# Altium project FMC_SDR.PrjPcb (part 2 of 2)

## Sheet Transceiver.SchDoc: FMC SDR Transceiver Board
size 420 x 297 mm; CheckedBy: -; CompanyName: CERN; DrawnBy: DrawnBy; Organization: CERN; Address1: European Organization for Nuclear Research; Address2: CH-1211 Genčve 23 - Switzerland; Revision: -; SheetNumber: -; SheetTotal: -; EDA_Number: EDA-XXXXX-VX-X; Projet: -; ModifiedBy: -; CreateDate: XX/XX/XXXX; CheckedDate: -; Title2: AD9364; DivGrp: TE/MPE; Designer: Designer; ModifiedDate: -
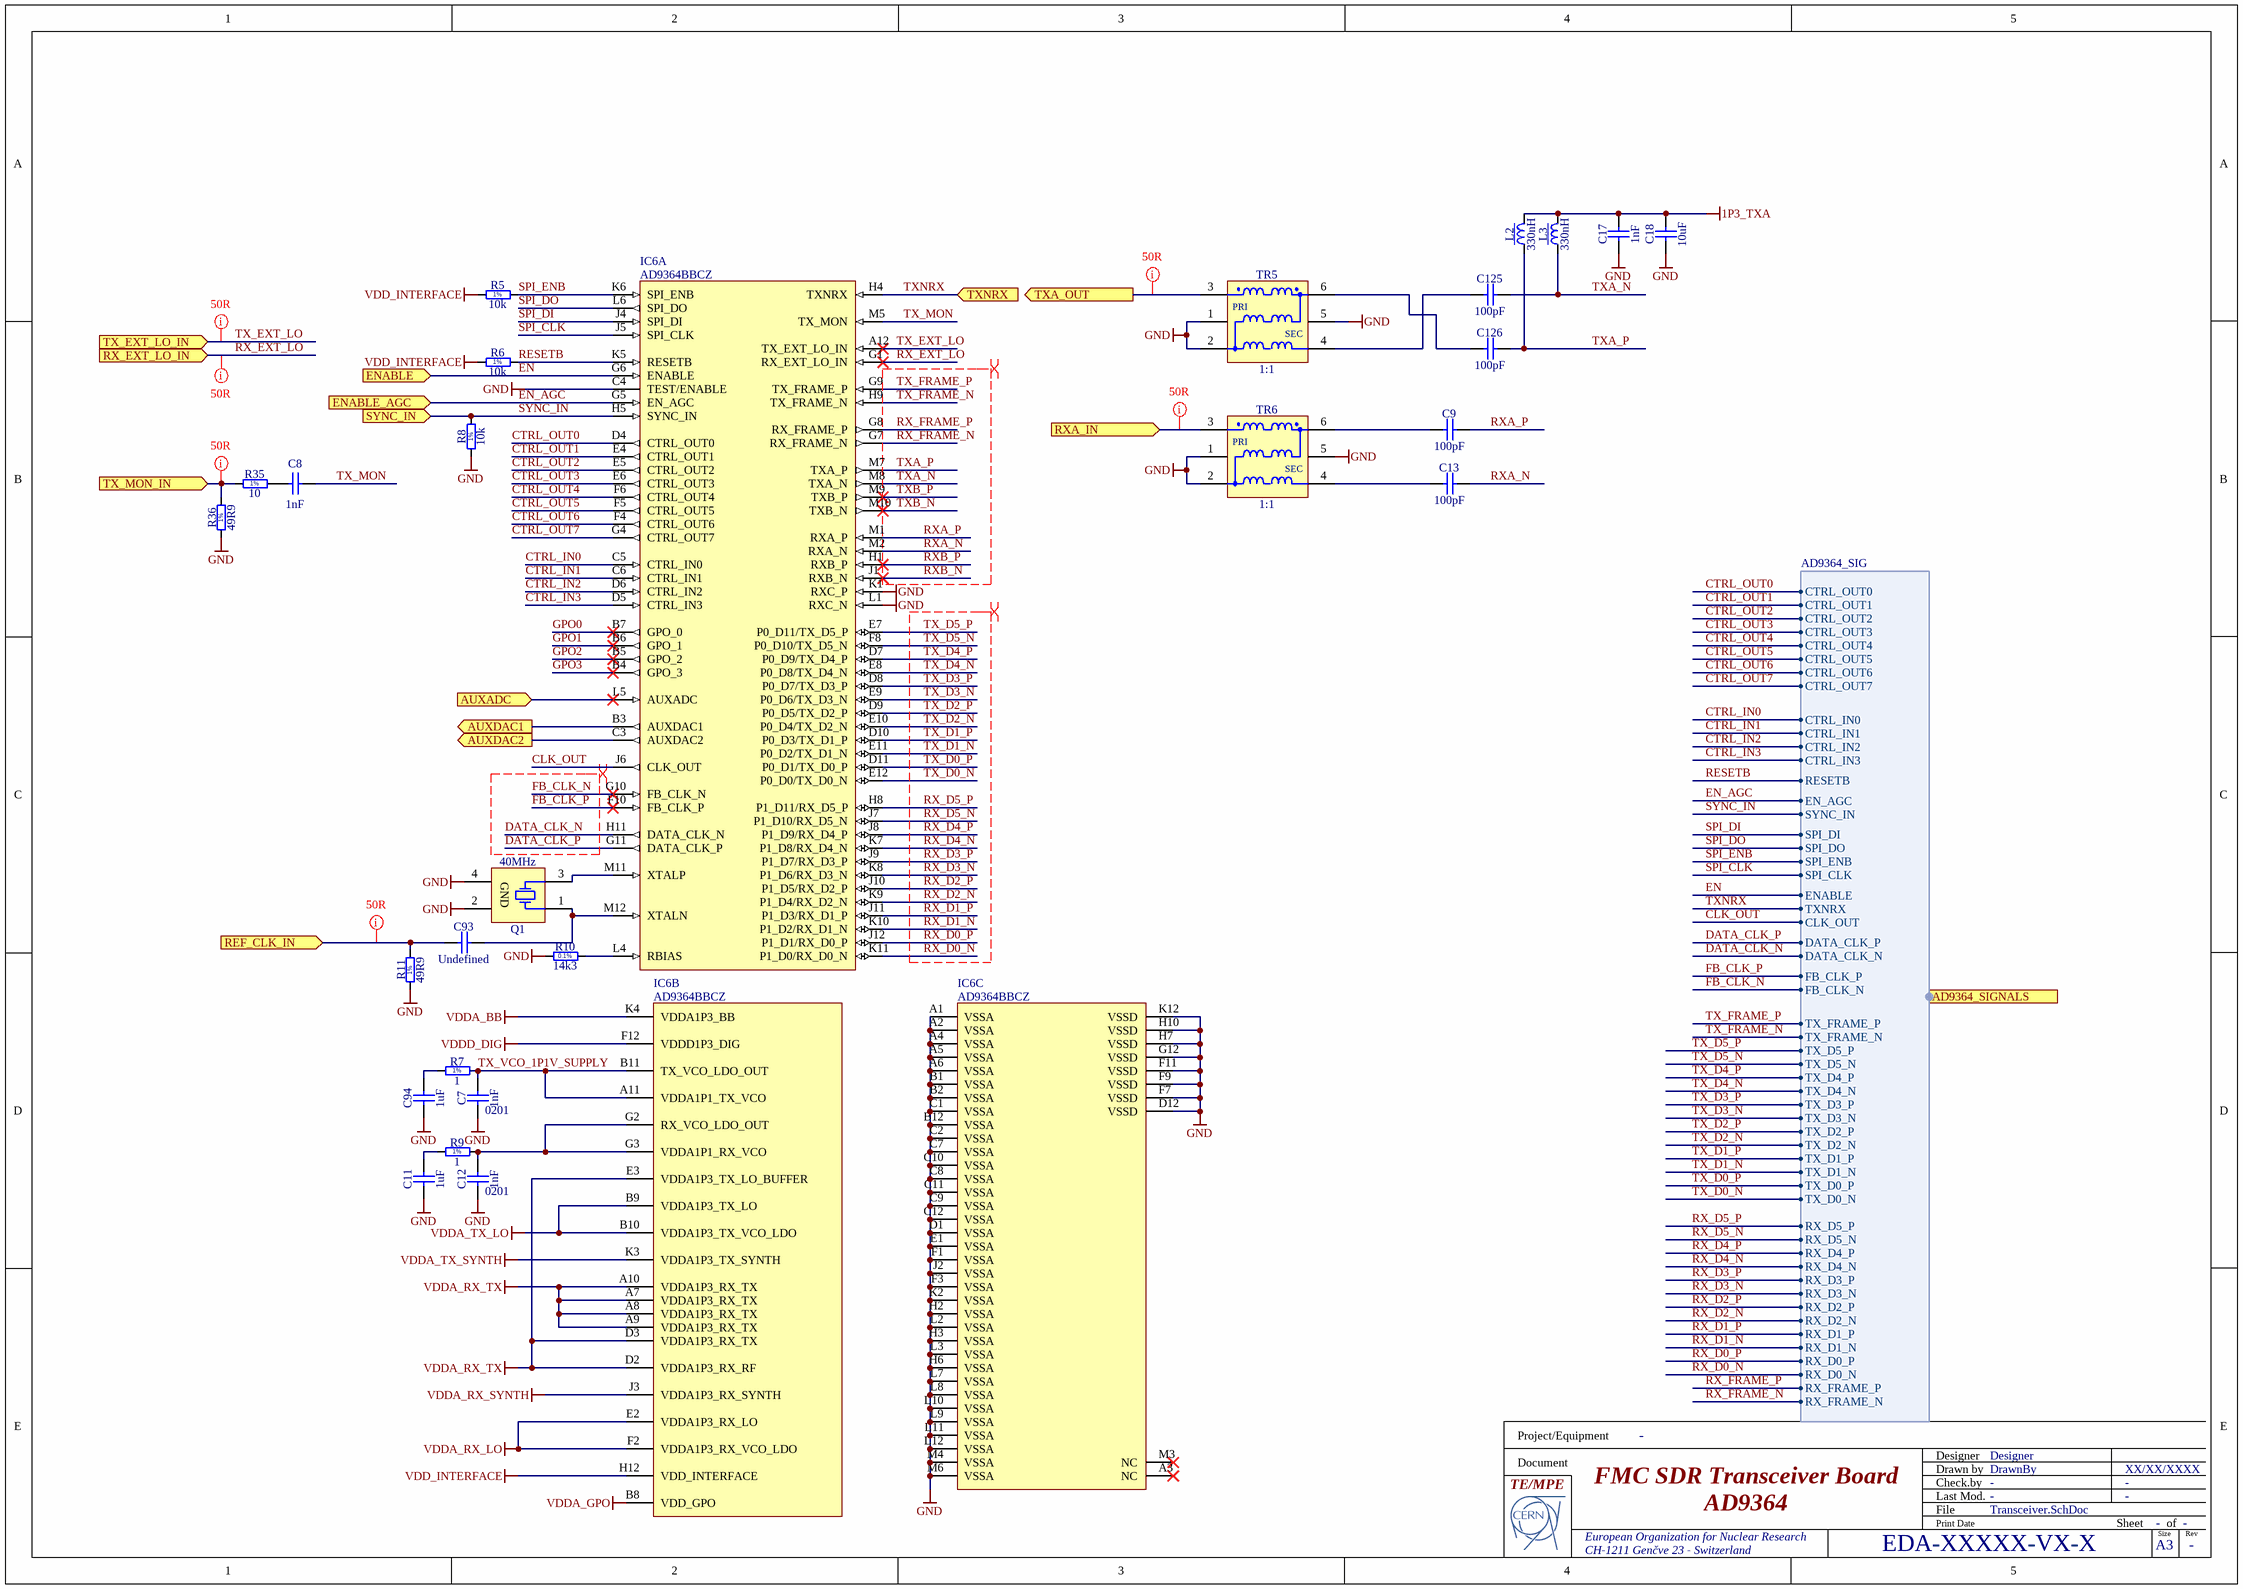
[diagram p3: Transceiver.SchDoc]

### Parts
C7  1nF  Case: 0201  [CAPC0603X33N]
C8  1nF  [CAPC1005X55N]
C9  100pF  [CAPC1005X55N]
C11  1uF  [CAPC1005X55N]
C12  1nF  Case: 0201  [CAPC0603X33N]
C13  100pF  [CAPC1005X55N]
C17  1nF  [CAPC1005X55N]
C18  10uF  [CAPC1608X80N]
C93  Undefined  [CAPC1608X90N]
C94  1uF  [CAPC1005X55N]
C125  100pF  [CAPC1005X55N]
C126  100pF  [CAPC1005X55N]
IC6  AD9364BBCZ  [BGA144C80P12X12_1000X1000X170]  (parts A,B,C of 3)
L2  330nH  [IND_COILCRAFT_0805CS]
L3  330nH  [IND_COILCRAFT_0805CS]
Q1  40MHz  [XTAL_EPSON_TSX-3225]
R5  10k  [RESC1005X40N]
R6  10k  [RESC1005X40N]
R7  1  [RESC1005X40N]
R8  10k  [RESC1005X40N]
R9  1  [RESC1005X40N]
R10  14k3  [RESC1608X55N]
R11  49R9  [RESC1005X40N]
R35  10  [RESC1005X40N]
R36  49R9  [RESC1005X40N]
TR5  1:1  [XFMR_MINI-CIRCUITS_DB1627]
TR6  1:1  [XFMR_MINI-CIRCUITS_DB1627]

### Ports
AD9364_SIGNALS (in, harness AD9364_SIG), AUXADC (in), AUXDAC1 (out), AUXDAC2 (out), ENABLE (in), ENABLE_AGC (in), REF_CLK_IN (in), RX_EXT_LO_IN (in), RXA_IN (in), SYNC_IN (in), TX_EXT_LO_IN (in), TX_MON_IN (in), TXA_OUT (out), TXNRX (in)

### Harnesses
AD9364_SIG: CTRL_OUT0, CTRL_OUT1, CTRL_OUT2, CTRL_OUT3, CTRL_OUT4, CTRL_OUT5, CTRL_OUT6, CTRL_OUT7, CTRL_IN0, CTRL_IN1, CTRL_IN2, CTRL_IN3, RESETB, EN_AGC, SYNC_IN, SPI_DI, SPI_DO, SPI_ENB, SPI_CLK, ENABLE, TXNRX, CLK_OUT, DATA_CLK_P, DATA_CLK_N, FB_CLK_P, FB_CLK_N, TX_FRAME_P, TX_FRAME_N, TX_D5_P, TX_D5_N, TX_D4_P, TX_D4_N, TX_D3_P, TX_D3_N, TX_D2_P, TX_D2_N, TX_D1_P, TX_D1_N, TX_D0_P, TX_D0_N, RX_D5_P, RX_D5_N, RX_D4_P, RX_D4_N, RX_D3_P, RX_D3_N, RX_D2_P, RX_D2_N, RX_D1_P, RX_D1_N, RX_D0_P, RX_D0_N, RX_FRAME_P, RX_FRAME_N

### Nets
1P3_TXA: C17.2 C18.2 IC6.A7(VDDA1P3_RX_TX) IC6.A8(VDDA1P3_RX_TX) IC6.A9(VDDA1P3_RX_TX) IC6.A10(VDDA1P3_RX_TX) IC6.D2(VDDA1P3_RX_RF) IC6.D3(VDDA1P3_RX_TX) IC6.E3(VDDA1P3_TX_LO_BUFFER) IC6.F12(VDDD1P3_DIG) IC6.K4(VDDA1P3_BB) L2.2 L3.2  [also labelled VDDA_BB, VDDA_RX_TX, VDDD_DIG]  [project net 1P3_SUPPLY_B]
GND: C7.1 C11.1 C12.1 C17.1 C18.1 C94.1 IC6.A1(VSSA) IC6.A2(VSSA) IC6.A4(VSSA) IC6.A5(VSSA) IC6.A6(VSSA) IC6.B1(VSSA) IC6.B2(VSSA) IC6.B12(VSSA) IC6.C1(VSSA) IC6.C2(VSSA) IC6.C4(TEST/ENABLE) IC6.C7(VSSA) IC6.C8(VSSA) IC6.C9(VSSA) IC6.C10(VSSA) IC6.C11(VSSA) IC6.C12(VSSA) IC6.D1(VSSA) IC6.D12(VSSD) IC6.E1(VSSA) IC6.F1(VSSA) IC6.F3(VSSA) IC6.F7(VSSD) IC6.F9(VSSD) IC6.F11(VSSD) IC6.G12(VSSD) IC6.H2(VSSA) IC6.H3(VSSA) IC6.H6(VSSA) IC6.H7(VSSD) IC6.H10(VSSD) IC6.J2(VSSA) IC6.K1(RXC_P) IC6.K2(VSSA) IC6.K12(VSSD) IC6.L1(RXC_N) IC6.L2(VSSA) IC6.L3(VSSA) IC6.L7(VSSA) IC6.L8(VSSA) IC6.L9(VSSA) IC6.L10(VSSA) IC6.L11(VSSA) IC6.L12(VSSA) IC6.M4(VSSA) IC6.M6(VSSA) Q1.2(GND) Q1.4(GND) R8.1 R10.1 R11.1 R36.1 TR5.1(NC) TR5.2(P1) TR5.5(NC) TR6.1(NC) TR6.2(P1) TR6.5(NC)
VDD_INTERFACE: IC6.H12(VDD_INTERFACE) R5.1 R6.1
VDDA_GPO: IC6.B8(VDD_GPO)
VDDA_RX_LO: IC6.B9(VDDA1P3_TX_LO) IC6.B10(VDDA1P3_TX_VCO_LDO) IC6.E2(VDDA1P3_RX_LO) IC6.F2(VDDA1P3_RX_VCO_LDO) IC6.J3(VDDA1P3_RX_SYNTH) IC6.K3(VDDA1P3_TX_SYNTH)  [also labelled VDDA_RX_SYNTH, VDDA_TX_LO, VDDA_TX_SYNTH]  [project net 1P3_SUPPLY_A]
CLK_OUT: IC6.J6(CLK_OUT) ; port AD9364_SIGNALS.CLK_OUT  [project net 9364_CLK_OUT]
CTRL_IN0: IC6.C5(CTRL_IN0) ; port AD9364_SIGNALS.CTRL_IN0  [project net 9364_CTRL_IN0]
CTRL_IN1: IC6.C6(CTRL_IN1) ; port AD9364_SIGNALS.CTRL_IN1  [project net 9364_CTRL_IN1]
CTRL_IN2: IC6.D6(CTRL_IN2) ; port AD9364_SIGNALS.CTRL_IN2  [project net 9364_CTRL_IN2]
CTRL_IN3: IC6.D5(CTRL_IN3) ; port AD9364_SIGNALS.CTRL_IN3  [project net 9364_CTRL_IN3]
CTRL_OUT0: IC6.D4(CTRL_OUT0) ; port AD9364_SIGNALS.CTRL_OUT0  [project net 9364_CTRL_OUT0]
CTRL_OUT1: IC6.E4(CTRL_OUT1) ; port AD9364_SIGNALS.CTRL_OUT1  [project net 9364_CTRL_OUT1]
CTRL_OUT2: IC6.E5(CTRL_OUT2) ; port AD9364_SIGNALS.CTRL_OUT2  [project net 9364_CTRL_OUT2]
CTRL_OUT3: IC6.E6(CTRL_OUT3) ; port AD9364_SIGNALS.CTRL_OUT3  [project net 9364_CTRL_OUT3]
CTRL_OUT4: IC6.F6(CTRL_OUT4) ; port AD9364_SIGNALS.CTRL_OUT4  [project net 9364_CTRL_OUT4]
CTRL_OUT5: IC6.F5(CTRL_OUT5) ; port AD9364_SIGNALS.CTRL_OUT5  [project net 9364_CTRL_OUT5]
CTRL_OUT6: IC6.F4(CTRL_OUT6) ; port AD9364_SIGNALS.CTRL_OUT6  [project net 9364_CTRL_OUT6]
CTRL_OUT7: IC6.G4(CTRL_OUT7) ; port AD9364_SIGNALS.CTRL_OUT7  [project net 9364_CTRL_OUT7]
DATA_CLK_N: IC6.H11(DATA_CLK_N) ; port AD9364_SIGNALS.DATA_CLK_N  [project net 9364_DATA_CLK_N]
DATA_CLK_P: IC6.G11(DATA_CLK_P) ; port AD9364_SIGNALS.DATA_CLK_P  [project net 9364_DATA_CLK_P]
EN: IC6.G6(ENABLE) ; port ENABLE, port AD9364_SIGNALS.ENABLE  [project net 9364_ENABLE]
EN_AGC: IC6.G5(EN_AGC) ; port ENABLE_AGC, port AD9364_SIGNALS.EN_AGC  [project net 9364_EN_AGC]
FB_CLK_N: IC6.G10(FB_CLK_N) ; port AD9364_SIGNALS.FB_CLK_N  [project net 9364_FB_CLK_N]
FB_CLK_P: IC6.F10(FB_CLK_P) ; port AD9364_SIGNALS.FB_CLK_P  [project net 9364_FB_CLK_P]
GPO0: IC6.B7(GPO_0)
GPO1: IC6.B6(GPO_1)
GPO2: IC6.B5(GPO_2)
GPO3: IC6.B4(GPO_3)
RESETB: IC6.K5(RESETB) R6.2 ; port AD9364_SIGNALS.RESETB  [project net 9364_RESETB]
RX_D0_N: IC6.K11(P1_D0/RX_D0_N) ; port AD9364_SIGNALS.RX_D0_N  [project net 9364_RX_D0_N]
RX_D0_P: IC6.J12(P1_D1/RX_D0_P) ; port AD9364_SIGNALS.RX_D0_P  [project net 9364_RX_D0_P]
RX_D1_N: IC6.K10(P1_D2/RX_D1_N) ; port AD9364_SIGNALS.RX_D1_N  [project net 9364_RX_D1_N]
RX_D1_P: IC6.J11(P1_D3/RX_D1_P) ; port AD9364_SIGNALS.RX_D1_P  [project net 9364_RX_D1_P]
RX_D2_N: IC6.K9(P1_D4/RX_D2_N) ; port AD9364_SIGNALS.RX_D2_N  [project net 9364_RX_D2_N]
RX_D2_P: IC6.J10(P1_D5/RX_D2_P) ; port AD9364_SIGNALS.RX_D2_P  [project net 9364_RX_D2_P]
RX_D3_N: IC6.K8(P1_D6/RX_D3_N) ; port AD9364_SIGNALS.RX_D3_N  [project net 9364_RX_D3_N]
RX_D3_P: IC6.J9(P1_D7/RX_D3_P) ; port AD9364_SIGNALS.RX_D3_P  [project net 9364_RX_D3_P]
RX_D4_N: IC6.K7(P1_D8/RX_D4_N) ; port AD9364_SIGNALS.RX_D4_N  [project net 9364_RX_D4_N]
RX_D4_P: IC6.J8(P1_D9/RX_D4_P) ; port AD9364_SIGNALS.RX_D4_P  [project net 9364_RX_D4_P]
RX_D5_N: IC6.J7(P1_D10/RX_D5_N) ; port AD9364_SIGNALS.RX_D5_N  [project net 9364_RX_D5_N]
RX_D5_P: IC6.H8(P1_D11/RX_D5_P) ; port AD9364_SIGNALS.RX_D5_P  [project net 9364_RX_D5_P]
RX_EXT_LO: IC6.G1(RX_EXT_LO_IN) ; port RX_EXT_LO_IN
RX_FRAME_N: IC6.G7(RX_FRAME_N) ; port AD9364_SIGNALS.RX_FRAME_N  [project net 9364_RX_FRAME_N]
RX_FRAME_P: IC6.G8(RX_FRAME_P) ; port AD9364_SIGNALS.RX_FRAME_P  [project net 9364_RX_FRAME_P]
RXA_N: C13.2 IC6.M2(RXA_N)
RXA_P: C9.2 IC6.M1(RXA_P)
RXB_N: IC6.J1(RXB_N)
RXB_P: IC6.H1(RXB_P)
SPI_CLK: IC6.J5(SPI_CLK) ; port AD9364_SIGNALS.SPI_CLK  [project net 9364_SPI_CLK]
SPI_DI: IC6.J4(SPI_DI) ; port AD9364_SIGNALS.SPI_DI  [project net 9364_SPI_DI]
SPI_DO: IC6.L6(SPI_DO) ; port AD9364_SIGNALS.SPI_DO  [project net 9364_SPI_DO]
SPI_ENB: IC6.K6(SPI_ENB) R5.2 ; port AD9364_SIGNALS.SPI_ENB  [project net 9364_SPI_ENB]
SYNC_IN: IC6.H5(SYNC_IN) R8.2 ; port SYNC_IN, port AD9364_SIGNALS.SYNC_IN  [project net 9364_SYNC_IN]
TX_D0_N: IC6.E12(P0_D0/TX_D0_N) ; port AD9364_SIGNALS.TX_D0_N  [project net 9364_TX_D0_N]
TX_D0_P: IC6.D11(P0_D1/TX_D0_P) ; port AD9364_SIGNALS.TX_D0_P  [project net 9364_TX_D0_P]
TX_D1_N: IC6.E11(P0_D2/TX_D1_N) ; port AD9364_SIGNALS.TX_D1_N  [project net 9364_TX_D1_N]
TX_D1_P: IC6.D10(P0_D3/TX_D1_P) ; port AD9364_SIGNALS.TX_D1_P  [project net 9364_TX_D1_P]
TX_D2_N: IC6.E10(P0_D4/TX_D2_N) ; port AD9364_SIGNALS.TX_D2_N  [project net 9364_TX_D2_N]
TX_D2_P: IC6.D9(P0_D5/TX_D2_P) ; port AD9364_SIGNALS.TX_D2_P  [project net 9364_TX_D2_P]
TX_D3_N: IC6.E9(P0_D6/TX_D3_N) ; port AD9364_SIGNALS.TX_D3_N  [project net 9364_TX_D3_N]
TX_D3_P: IC6.D8(P0_D7/TX_D3_P) ; port AD9364_SIGNALS.TX_D3_P  [project net 9364_TX_D3_P]
TX_D4_N: IC6.E8(P0_D8/TX_D4_N) ; port AD9364_SIGNALS.TX_D4_N  [project net 9364_TX_D4_N]
TX_D4_P: IC6.D7(P0_D9/TX_D4_P) ; port AD9364_SIGNALS.TX_D4_P  [project net 9364_TX_D4_P]
TX_D5_N: IC6.F8(P0_D10/TX_D5_N) ; port AD9364_SIGNALS.TX_D5_N  [project net 9364_TX_D5_N]
TX_D5_P: IC6.E7(P0_D11/TX_D5_P) ; port AD9364_SIGNALS.TX_D5_P  [project net 9364_TX_D5_P]
TX_EXT_LO: IC6.A12(TX_EXT_LO_IN) ; port TX_EXT_LO_IN
TX_FRAME_N: IC6.H9(TX_FRAME_N) ; port AD9364_SIGNALS.TX_FRAME_N  [project net 9364_TX_FRAME_N]
TX_FRAME_P: IC6.G9(TX_FRAME_P) ; port AD9364_SIGNALS.TX_FRAME_P  [project net 9364_TX_FRAME_P]
TX_MON: C8.1 IC6.M5(TX_MON)
TX_VCO_1P1V_SUPPLY: C7.2 IC6.A11(VDDA1P1_TX_VCO) IC6.B11(TX_VCO_LDO_OUT) R7.2
TXA_N: C125.2 IC6.M8(TXA_N) L3.1
TXA_P: C126.2 IC6.M7(TXA_P) L2.1
TXB_N: IC6.M10(TXB_N)
TXB_P: IC6.M9(TXB_P)
TXNRX: IC6.H4(TXNRX) ; port TXNRX, port AD9364_SIGNALS.TXNRX  [project net 9364_TXNRX]
NetBSC1_1: TR5.3(P1) ; port TXA_OUT
NetBSC2_1: C93.1 R11.2 ; port REF_CLK_IN
NetBSC3_1: R35.1 R36.2 ; port TX_MON_IN
NetBSC5_1: TR6.3(P1) ; port RXA_IN
NetBSC14_1: IC6.B3(AUXDAC1) ; port AUXDAC1
NetBSC21_1: IC6.L5(AUXADC) ; port AUXADC
NetC8_2: C8.2 R35.2
NetC9_1: C9.1 TR6.6(S1)
NetC11_2: C11.2 R9.1
NetC12_2: C12.2 IC6.G2(RX_VCO_LDO_OUT) IC6.G3(VDDA1P1_RX_VCO) R9.2
NetC13_1: C13.1 TR6.4(S1)
NetC93_2: C93.2 IC6.M12(XTALN) Q1.1(X)
NetC94_2: C94.2 R7.1
NetC125_1: C125.1 TR5.4(S1)
NetC126_1: C126.1 TR5.6(S1)
NetIC6_C3: IC6.C3(AUXDAC2) ; port AUXDAC2
NetIC6_L4: IC6.L4(RBIAS) R10.2
NetIC6_M11: IC6.M11(XTALP) Q1.3(X)

Not connected (* = marked no-connect by the designer): IC6 A3(NC)* M3(NC)*

### Layout directives
differential pair: DATA_CLK_N, DATA_CLK_P, FB_CLK_N, FB_CLK_P, RX_D0_N, RX_D0_P, RX_D1_N, RX_D1_P, RX_D2_N, RX_D2_P, RX_D3_N, RX_D3_P, RX_D4_N, RX_D4_P, RX_D5_N, RX_D5_P, RX_FRAME_N, RX_FRAME_P, RXA_N, RXA_P, RXB_N, RXB_P, TX_D0_N, TX_D0_P, TX_D1_N, TX_D1_P, TX_D2_N, TX_D2_P, TX_D3_N, TX_D3_P, TX_D4_N, TX_D4_P, TX_D5_N, TX_D5_P, TX_FRAME_N, TX_FRAME_P, TXA_N, TXA_P, TXB_N, TXB_P
net class 50R_class: NetBSC1_1, NetBSC2_1, NetBSC3_1, NetBSC5_1, RX_EXT_LO, TX_EXT_LO

### Notes on the sheet
- Project/Equipment
- Document
- Designer
- Drawn by
- Check.by
- File
- Last Mod.
- Print Date
- Sheet
- Size
- A3
- of
- Rev
- (in symbol R0402_1R_1%_0.0625W_200PPM) 1%
- (in symbol R0402_10K_1%_0.0625W_100PPM) 1%
- (in symbol R0402_10R_1%_0.0625W_200PPM) 1%
- (in symbol R0402_49R9_1%_0.0625W_100PPM) 1%
- (in symbol R0603_14K3_0.1%_0.063W_10PPM) 0.1%
- (in symbol XFMR_MINI-CIRCUITS_TCM1-63AX+) PRI; SEC

### Library data of the parts
C7 C12 = CC0201_1NF_16V_10%_X5R: Non-polarised capacitor; Part Description: SMD Multilayer Chip Ceramic Capacitor; Manufacturer: GENERIC; Manufacturer1 Part Number: 0201YD102KAT2A; Voltage: 16V; TC: X5R; Tolerance: ±10%; Part Number: CC0201_1NF_16V_10%_X5R; Component Kind: Standard; Component Type: Standard; Pin Count: 2; Value: 1nF; Status: Not Recommended; Manufacturer Part Number: CC0201_1NF_16V_10%_X5R; Mounted: Yes; Socket: No; SMD: Yes; Sense: No; Manufacturer1 Example: AVX; Manufacturer1 ComponentHeight: 0.33mm; HelpURL: \\cern.ch\dfs\Applications\Altium\Datasheets\CC0201_X5R_AVX.pdf; Author: CERN DEM JLC; CreateDate: 03.12.2007; LatestRevisionDate: 03.12.2007
C8 C17 = CC0402_1NF_50V_10%_X7R: Non-polarised capacitor; Part Description: SMD Multilayer Chip Ceramic Capacitor; Manufacturer: GENERIC; Manufacturer1 Part Number: 223858715623; Voltage: 50V; TC: X7R; Tolerance: ±10%; Part Number: CC0402_1NF_50V_10%_X7R; Component Kind: Standard; Component Type: Standard; Pin Count: 2; Value: 1nF; Status: Not Recommended; Manufacturer Part Number: CC0402_1NF_50V_10%_X7R; Case: 0402; Mounted: Yes; Socket: No; SMD: Yes; Sense: No; Manufacturer1 Example: PHYCOMP; Manufacturer1 ComponentHeight: 0.55mm; HelpURL: \\cern.ch\dfs\Applications\Altium\Datasheets\CC0402_X7R_PHYCOMP.pdf; Author: CERN DEM JLC; CreateDate: 03.12.2007; LatestRevisionDate: 03.12.2007
C9 C13 C125 C126 = CC0402_100PF_50V_5%_C0G: Non-polarised capacitor; Part Description: SMD Multilayer Chip Ceramic Capacitor; Manufacturer: GENERIC; Manufacturer1 Part Number: C0402C101J5GACTU; Voltage: 50V; TC: C0G/NP0; Tolerance: ±5%; Part Number: CC0402_100PF_50V_5%_C0G; Component Kind: Standard; Component Type: Standard; Pin Count: 2; Value: 100pF; Status: Preferred; Manufacturer Part Number: CC0402_100PF_50V_5%_C0G; Case: 0402; Mounted: Yes; Socket: No; SMD: Yes; Sense: No; Manufacturer1 Example: KEMET; Manufacturer1 ComponentHeight: 0.55mm; HelpURL: \\cern.ch\dfs\Applications\Altium\Datasheets\CC0805_C0G_KEMET_(Commercial Grade).pdf; Author: CERN DEM JLC; CreateDate: 03.12.2007; LatestRevisionDate: 22.04.2015
C11 C94 = CC0402_1UF_16V_10%_X5R: Non-polarised capacitor; Part Description: SMD Multilayer Chip Ceramic Capacitor; Manufacturer: GENERIC; Manufacturer1 Part Number: C1005X5R1C105KT; Voltage: 16V; TC: X5R; Tolerance: ±10%; Part Number: CC0402_1UF_16V_10%_X5R; Component Kind: Standard; Component Type: Standard; Pin Count: 2; Value: 1uF; Status: Preferred; Manufacturer Part Number: CC0402_1UF_16V_10%_X5R; Case: 0402; Mounted: Yes; Socket: No; SMD: Yes; Sense: No; Manufacturer1 Example: TDK; Manufacturer1 ComponentHeight: 0.55mm; HelpURL: \\cern.ch\dfs\Applications\Altium\Datasheets\CC0402_X5R_TDK_C.pdf; Author: CERN DEM JLC; CreateDate: 25.10.2012; LatestRevisionDate: 25.10.2012
C18 = CC0603_10UF_10V_10%_X5R: Non-polarised capacitor; Part Description: SMD Multilayer Chip Ceramic Capacitor; Manufacturer: GENERIC; Manufacturer1 Part Number: GRM188R61A106KE69D; Voltage: 10V; TC: X5R; Tolerance: ±10%; Part Number: CC0603_10UF_10V_10%_X5R; Component Kind: Standard; Component Type: Standard; Pin Count: 2; Value: 10uF; Status: None; Manufacturer Part Number: CC0603_10UF_10V_10%_X5R; Case: 0603; Mounted: Yes; Socket: No; SMD: Yes; Sense: No; Manufacturer1 Example: MURATA; Manufacturer1 ComponentHeight: 0.8mm; HelpURL: \\cern.ch\dfs\Applications\Altium\Datasheets\CC0603_MURATA_GRM188R61A106KE69D.pdf; Author: CERN DEM JLC; CreateDate: 31.01.2017; LatestRevisionDate: 31.01.2017
C93 = CC0603_NO-VALUE: Non-polarised capacitor; Part Description: Reserved Footprint For 0603(1608) Chip Ceramic Capacitor; Mounted: No; Part Number: CC0603_NO-VALUE; Component Kind: Standard; Component Type: Standard; Pin Count: 2; Value: Undefined; Status: None; Manufacturer: Undefined; Manufacturer Part Number: CC0603_NO-VALUE; Case: 0603; Socket: No; SMD: Yes; Sense: No; Manufacturer1 ComponentHeight: 0.9mm; HelpURL: Undefined; Author: CERN DEM MR; CreateDate: 22.11.2016; LatestRevisionDate: 22.11.2016
IC6 = AD9364BBCZ: RF 1×1 transceiver with integrated 12-bit DACs and ADCs; Manufacturer: ANALOG DEVICES; PressFit: No; Bonding: No; Part Number: AD9364BBCZ; Component Kind: Standard; Component Type: Standard; Device: AD9364BBCZ; PackageDescription: BGA, 0.80mm Pitch, Square; 144 Pin,12 Columns X 12 Rows,10.00mm X 10.00mm X 1.70mm H; Part Description: RF 1 × 1 Transceiver with Integrated 12-bit DACs and ADCs; Manufacturer Part Number: AD9364BBCZ; Pin Count: 144; Case: BGA144; Mounted: Yes; Socket: No; SMD: Yes; Sense: No; ComponentHeight: 1.7mm; Author: CERN DEM JLC; HelpURL: \\cern.ch\dfs\Applications\Altium\Datasheets\AD9364BBCZ.pdf; CreateDate: 06.12.2018; LatestRevisionDate: 06.12.2018
L2 L3 = IND_330NH_2%_COILCRAFT_0805CS: Inductor With Core; Part Description: SMT Chip Inductor; Manufacturer Part Number: 0805CS-331XGL; Power: 310mA; Resistance: 1.4R; Tolerance: ±2%; Part Number: IND_330NH_2%_COILCRAFT_0805CS; Component Kind: Standard; Component Type: Standard; Pin Count: 2; Value: 330nH; Status: None; Manufacturer: COILCRAFT; Case: 0805; Mounted: Yes; Socket: No; SMD: Yes; Sense: No; ComponentHeight: 1.52mm; HelpURL: \\cern.ch\dfs\Applications\Altium\Datasheets\IND_COILCRAFT_0805CS.pdf; Author: CERN DEM JMW; CreateDate: 26.10.2015; LatestRevisionDate: 26.10.2015
Q1 = X_CRYSTAL_SMD_3.2x2.5_40MHz: 40MHz ±10ppm Crystal 7pF 40 Ohms 4-SMD, No Lead; Part Number: XTAL_24MHZ_EPSON_ X1E000021036701; Part Description: Tolerance ±10 ppm,  Stability:± 10ppm, -40°C to 85°C, 9pF, Surface Mount Quartz Crystal, TX-3225 Series; Manufacturer: EPSON; Manufacturer Part Number: X1E000021036701; PressFit: No; Component Kind: Standard; Component Type: Standard; PackageDescription: Crystal TSX-3225 Serie, Corner Concave; 4 pin, 2.50mm L X 3.2mm W X 0.6mm H; Value: 40MHz; Pin Count: 4; Mounted: Yes; Socket: No; SMD: Yes; Sense: No; Bonding: No; ComponentHeight: 0.6mm; HelpURL: \\cern.ch\dfs\Applications\Altium\Datasheets\XTAL_EPSON_TSX-3225.pdf; ComponentLink1URL: \\cern.ch\dfs\Applications\Altium\Datasheets\XTAL_EPSON_TSX-3225_Ordering-Informations.pdf; ComponentLink1Description: Ordering Informations; Author: GK; CreateDate: 06.10.2016; LatestRevisionDate: 06.10.2016
R5 R6 R8 = R0402_10K_1%_0.0625W_100PPM: Resistor - 1%; Part Description: General Purpose Thick Film Chip Resistor; Manufacturer: GENERIC; Manufacturer1 Part Number: 232270671003L; TC: ±100ppm/°C; PressFit: No; Part Number: R0402_10K_1%_0.0625W_100PPM; Component Kind: Standard; Component Type: Standard; Pin Count: 2; Value: 10k; Status: Not Recommended; Power: 0.0625W; Tolerance: ±1%; Manufacturer Part Number: R0402_10K_1%_0.0625W_100PPM; Case: 0402; Mounted: Yes; Sense: No; Socket: No; SMD: Yes; Manufacturer1 Example: YAGEO PHYCOMP; Manufacturer1 ComponentHeight: 0.4mm; HelpURL: \\cern.ch\dfs\Applications\Altium\Datasheets\R0402_Phycomp_RC0402.pdf; Author: CERN DEM JLC; CreateDate: 03.12.2007; LatestRevisionDate: 17.10.2012
R7 R9 = R0402_1R_1%_0.0625W_200PPM: Resistor - 1%; Part Description: General Purpose Thick Film Chip Resistor; Manufacturer: GENERIC; Manufacturer1 Part Number: 232270671008L; TC: ±200ppm/°C; PressFit: No; Part Number: R0402_1R_1%_0.0625W_200PPM; Component Kind: Standard; Component Type: Standard; Pin Count: 2; Value: 1; Status: Not Recommended; Power: 0.0625W; Tolerance: ±1%; Manufacturer Part Number: R0402_1R_1%_0.0625W_200PPM; Case: 0402; Mounted: Yes; Sense: No; Socket: No; SMD: Yes; Manufacturer1 Example: YAGEO PHYCOMP; Manufacturer1 ComponentHeight: 0.4mm; HelpURL: \\cern.ch\dfs\Applications\Altium\Datasheets\R0402_Phycomp_RC0402.pdf; Author: CERN DEM JLC; CreateDate: 03.12.2007; LatestRevisionDate: 17.10.2012
R10 = R0603_14K3_0.1%_0.063W_10PPM: Resistor - 0.1%; Part Description: Thin Film Chip Resistor; Manufacturer: GENERIC; Manufacturer1 Part Number: RN73C1J14K3BTDF; Power: 0.063W; TC: ±10ppm; PressFit: No; Part Number: R0603_14K3_0.1%_0.063W_10PPM; Component Kind: Standard; Component Type: Standard; Pin Count: 2; Value: 14k3; Status: Not Recommended; Tolerance: ±0.1%; Manufacturer Part Number: R0603_14K3_0.1%_0.063W_10PPM; Case: 0603; Mounted: Yes; Sense: No; Socket: No; SMD: Yes; Manufacturer1 Example: TYCO HOLSWORTHY; Manufacturer1 ComponentHeight: 0.5mm; HelpURL: \\cern.ch\dfs\Applications\Altium\Datasheets\R0603_Tyco_RN73.pdf; Author: CERN DEM JLC; CreateDate: 03.12.2007; LatestRevisionDate: 13.03.2008
R11 R36 = R0402_49R9_1%_0.0625W_100PPM: Resistor - 1%; Part Description: General Purpose Thick Film Chip Resistor; Manufacturer: GENERIC; Manufacturer1 Part Number: 232270674999L or RC0402FR-0749R9L; TC: ±100ppm/°C; PressFit: No; Part Number: R0402_49R9_1%_0.0625W_100PPM; Component Kind: Standard; Component Type: Standard; Pin Count: 2; Value: 49R9; Status: Not Recommended; Power: 0.0625W; Tolerance: ±1%; Manufacturer Part Number: R0402_49R9_1%_0.0625W_100PPM; Case: 0402; Mounted: Yes; Sense: No; Socket: No; SMD: Yes; Manufacturer1 Example: YAGEO PHYCOMP; Manufacturer1 ComponentHeight: 0.4mm; HelpURL: \\cern.ch\dfs\Applications\Altium\Datasheets\R0402_Phycomp_RC0402.pdf; Author: CERN DEM JLC; CreateDate: 24.10.2012; LatestRevisionDate: 24.10.2012
R35 = R0402_10R_1%_0.0625W_200PPM: Resistor - 1%; Part Description: General Purpose Thick Film Chip Resistor; Manufacturer: GENERIC; Manufacturer1 Part Number: 232270671009L; TC: ±200ppm/°C; PressFit: No; Part Number: R0402_10R_1%_0.0625W_200PPM; Component Kind: Standard; Component Type: Standard; Pin Count: 2; Value: 10; Status: Not Recommended; Power: 0.0625W; Tolerance: ±1%; Manufacturer Part Number: R0402_10R_1%_0.0625W_200PPM; Case: 0402; Mounted: Yes; Sense: No; Socket: No; SMD: Yes; Manufacturer1 Example: YAGEO PHYCOMP; Manufacturer1 ComponentHeight: 0.4mm; HelpURL: \\cern.ch\dfs\Applications\Altium\Datasheets\R0402_Phycomp_RC0402.pdf; Author: CERN DEM JLC; CreateDate: 24.06.2009; LatestRevisionDate: 17.10.2012
TR5 TR6 = XFMR_MINI-CIRCUITS_TCM1-63AX+: 50 Ohms 10  to 6000MHz RF Transformer; Power: 0.2W; Part Number: XFMR_MINI-CIRCUITS_TCM1-63AX+; Component Kind: Standard; Component Type: Standard; Pin Count: 6; Value: 1:1; Status: None; Part Description: 50 Ohms 10  to 6000MHz RF Transformer; Manufacturer: MINI-CIRCUITS; Manufacturer Part Number: TCM1-63AX+; Mounted: Yes; Socket: No; Sense: No; SMD: Yes; ComponentHeight: 4.06mm; HelpURL: \\cern.ch\dfs\Applications\Altium\Datasheets\XFMR_MINI-CIRCUITS_TCM1-63AX+.pdf; Author: CERN DEM MR; CreateDate: 08.02.2019; LatestRevisionDate: 08.02.2019

## Sheet fmc_connector.SchDoc: FMC SDR Transceiver Board
size 420 x 297 mm; CheckedBy: -; CompanyName: CERN; DrawnBy: DrawnBy; Organization: CERN; Address1: European Organization for Nuclear Research; Address2: CH-1211 Genčve 23 - Switzerland; Revision: -; SheetNumber: -; SheetTotal: -; EDA_Number: EDA-XXXXX-VX-X; Projet: -; ModifiedBy: -; CreateDate: XX/XX/XXXX; CheckedDate: -; Title2: FMC Connector; DivGrp: TE/MPE; Designer: Designer; ModifiedDate: -
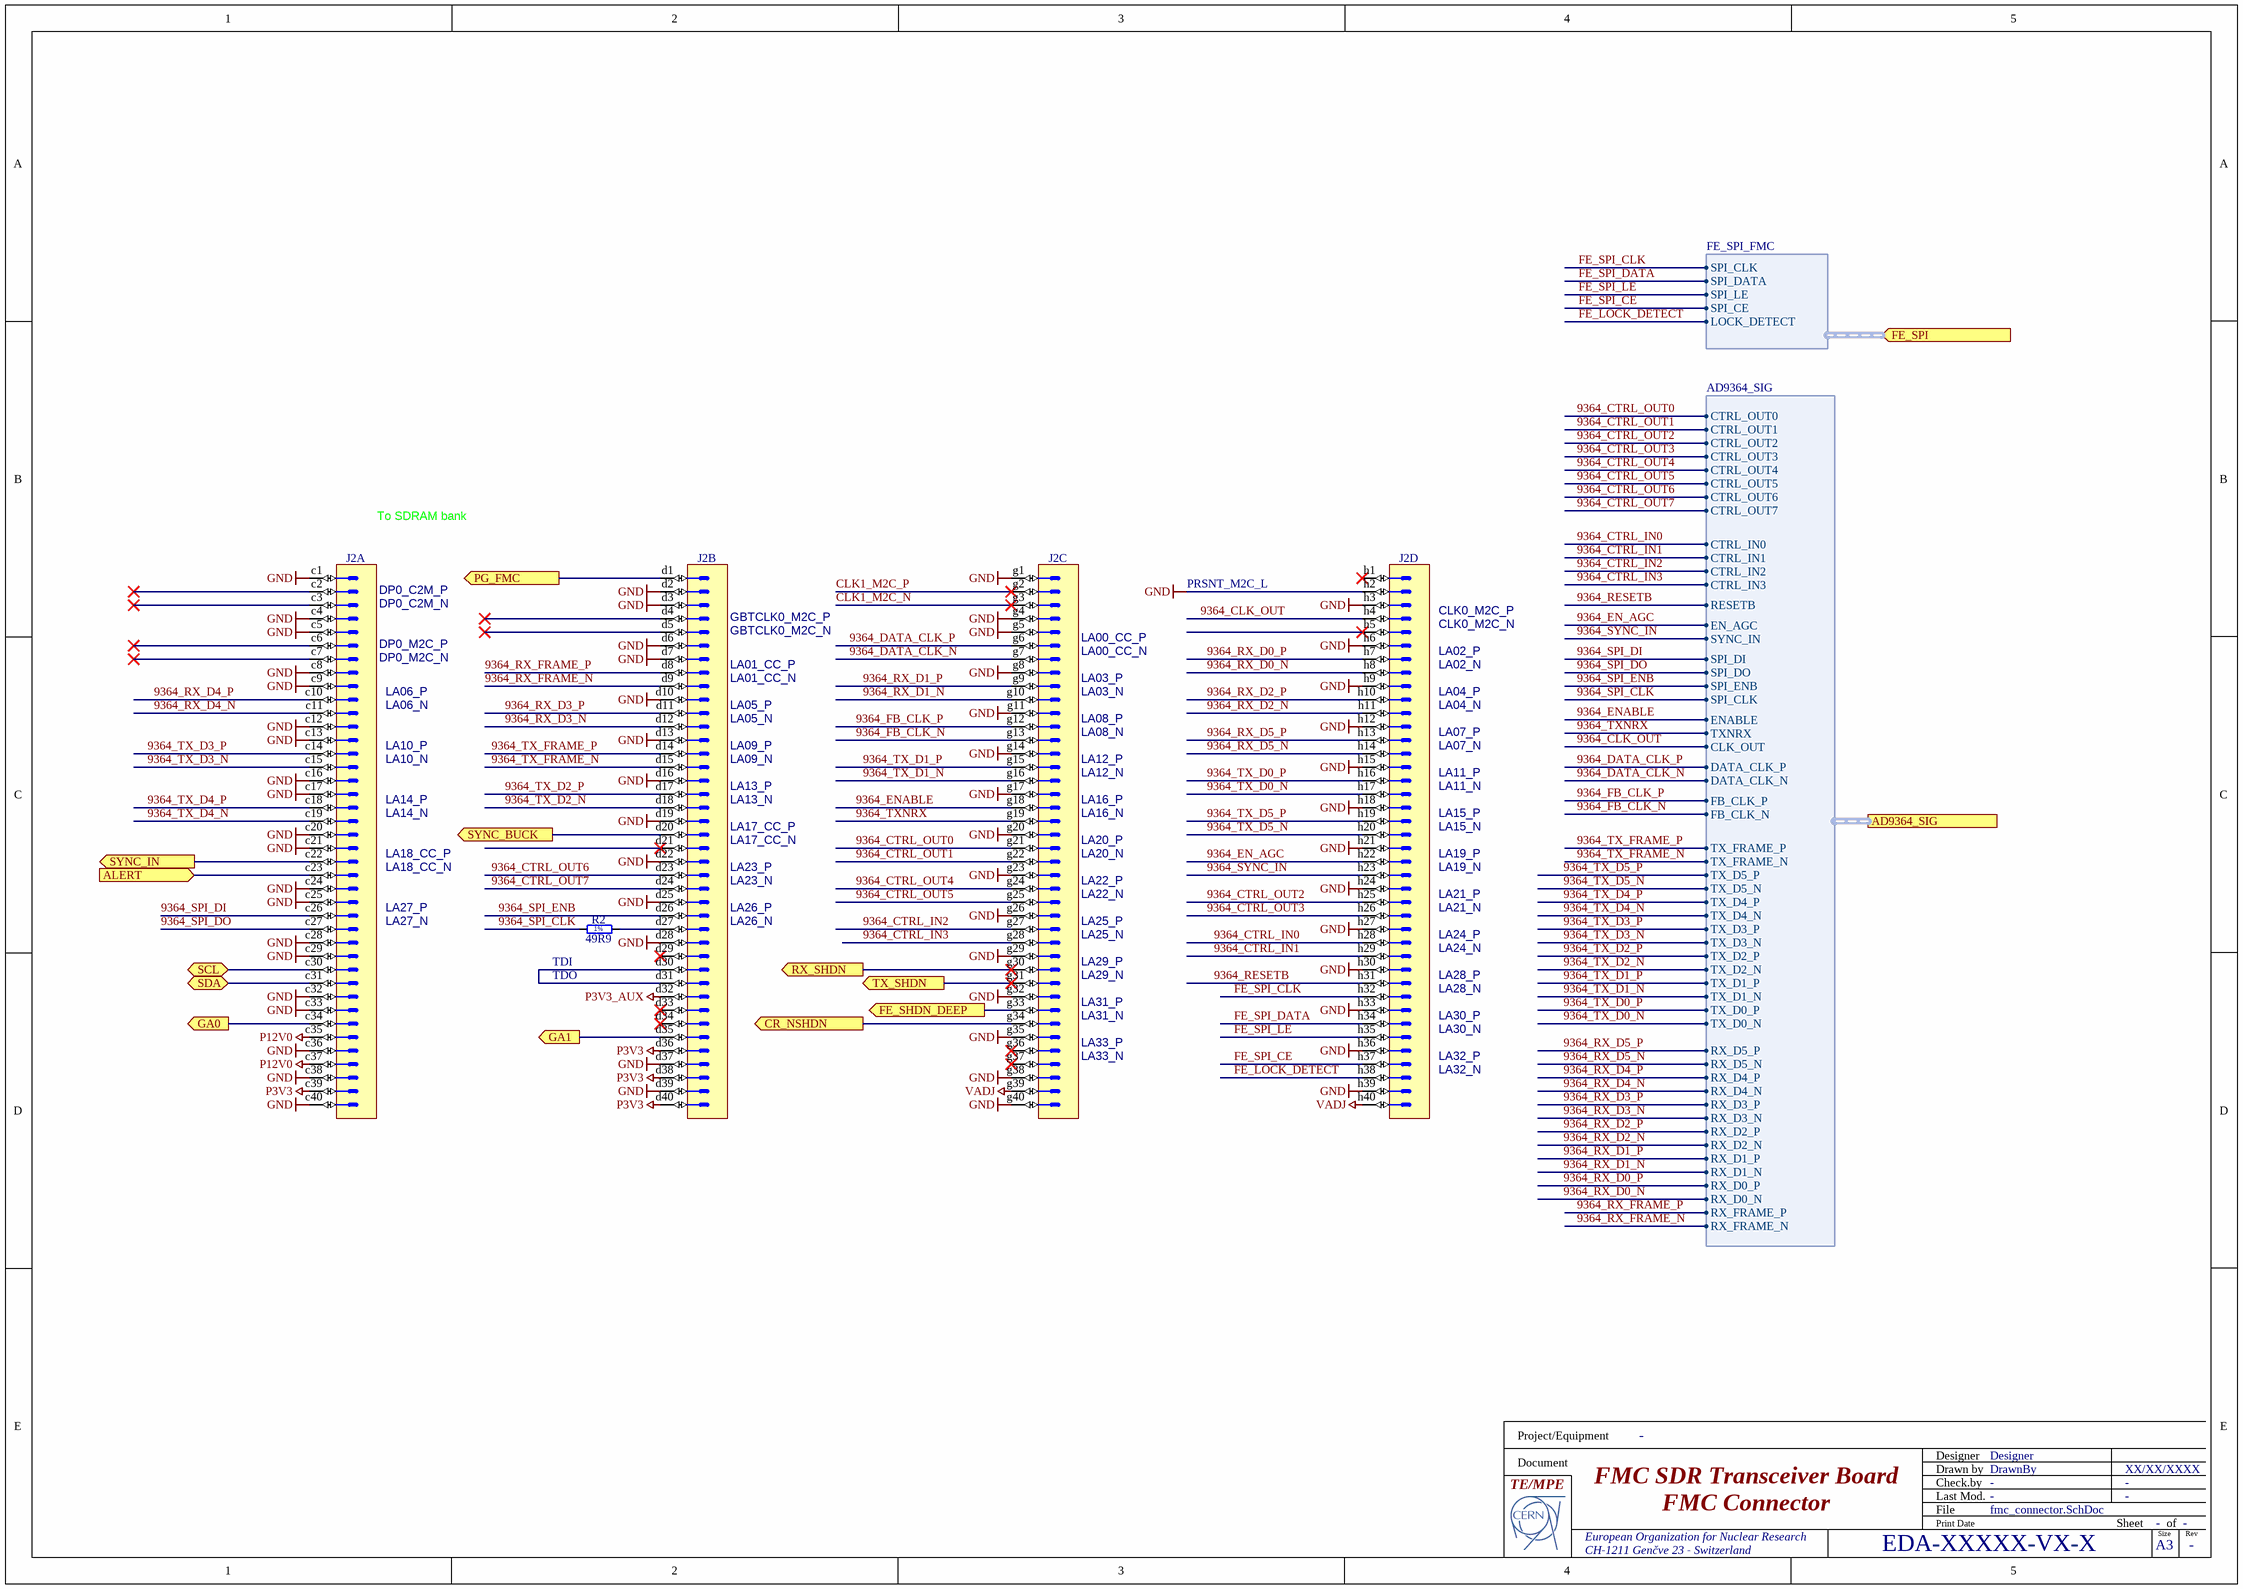
[diagram p4: fmc_connector.SchDoc]

### Parts
J2  VITA 57  [SAMTEC_ASP-127797-01]  (value not drawn)  (parts A,B,C,D of 4)
R2  49R9  [RESC1005X40N]

### Ports
AD9364_SIG (harness AD9364_SIG), ALERT (in), CR_NSHDN (out), FE_SHDN_DEEP (out), FE_SPI (in, harness FE_SPI_FMC), GA0 (out), GA1 (out), PG_FMC (out), RX_SHDN (out), SCL (bidir), SDA (bidir), SYNC_BUCK (out), SYNC_IN (out), TX_SHDN (out)

### Harnesses
AD9364_SIG: CTRL_OUT0, CTRL_OUT1, CTRL_OUT2, CTRL_OUT3, CTRL_OUT4, CTRL_OUT5, CTRL_OUT6, CTRL_OUT7, CTRL_IN0, CTRL_IN1, CTRL_IN2, CTRL_IN3, RESETB, EN_AGC, SYNC_IN, SPI_DI, SPI_DO, SPI_ENB, SPI_CLK, ENABLE, TXNRX, CLK_OUT, DATA_CLK_P, DATA_CLK_N, FB_CLK_P, FB_CLK_N, TX_FRAME_P, TX_FRAME_N, TX_D5_P, TX_D5_N, TX_D4_P, TX_D4_N, TX_D3_P, TX_D3_N, TX_D2_P, TX_D2_N, TX_D1_P, TX_D1_N, TX_D0_P, TX_D0_N, RX_D5_P, RX_D5_N, RX_D4_P, RX_D4_N, RX_D3_P, RX_D3_N, RX_D2_P, RX_D2_N, RX_D1_P, RX_D1_N, RX_D0_P, RX_D0_N, RX_FRAME_P, RX_FRAME_N
FE_SPI_FMC: SPI_CLK, SPI_DATA, SPI_LE, SPI_CE, LOCK_DETECT

### Nets
GND: J2.c1 J2.c4 J2.c5 J2.c8 J2.c9 J2.c12 J2.c13 J2.c16 J2.c17 J2.c20 J2.c21 J2.c24 J2.c25 J2.c28 J2.c29 J2.c32 J2.c33 J2.c36 J2.c38 J2.c40 J2.d2 J2.d3 J2.d6 J2.d7 J2.d10 J2.d13 J2.d16 J2.d19 J2.d22 J2.d25 J2.d28 J2.d37 J2.d39 J2.g1 J2.g4 J2.g5 J2.g8 J2.g11 J2.g14 J2.g17 J2.g20 J2.g23 J2.g26 J2.g29 J2.g32 J2.g35 J2.g38 J2.g40 J2.h2 J2.h3 J2.h6 J2.h9 J2.h12 J2.h15 J2.h18 J2.h21 J2.h24 J2.h27 J2.h30 J2.h33 J2.h36 J2.h39
P3V3: J2.c39 J2.d36 J2.d38 J2.d40
P3V3_AUX: J2.d32
P12V0: J2.c35 J2.c37
VADJ: J2.g39 J2.h40
9364_CLK_OUT: J2.h4 ; port AD9364_SIG.CLK_OUT
9364_CTRL_IN0: J2.h28 ; port AD9364_SIG.CTRL_IN0
9364_CTRL_IN1: J2.h29 ; port AD9364_SIG.CTRL_IN1
9364_CTRL_IN2: J2.g27 ; port AD9364_SIG.CTRL_IN2
9364_CTRL_IN3: J2.g28 ; port AD9364_SIG.CTRL_IN3
9364_CTRL_OUT0: J2.g21 ; port AD9364_SIG.CTRL_OUT0
9364_CTRL_OUT1: J2.g22 ; port AD9364_SIG.CTRL_OUT1
9364_CTRL_OUT2: J2.h25 ; port AD9364_SIG.CTRL_OUT2
9364_CTRL_OUT3: J2.h26 ; port AD9364_SIG.CTRL_OUT3
9364_CTRL_OUT4: J2.g24 ; port AD9364_SIG.CTRL_OUT4
9364_CTRL_OUT5: J2.g25 ; port AD9364_SIG.CTRL_OUT5
9364_CTRL_OUT6: J2.d23 ; port AD9364_SIG.CTRL_OUT6
9364_CTRL_OUT7: J2.d24 ; port AD9364_SIG.CTRL_OUT7
9364_DATA_CLK_N: J2.g7 ; port AD9364_SIG.DATA_CLK_N
9364_DATA_CLK_P: J2.g6 ; port AD9364_SIG.DATA_CLK_P
9364_EN_AGC: J2.h22 ; port AD9364_SIG.EN_AGC
9364_ENABLE: J2.g18 ; port AD9364_SIG.ENABLE
9364_FB_CLK_N: J2.g13 ; port AD9364_SIG.FB_CLK_N
9364_FB_CLK_P: J2.g12 ; port AD9364_SIG.FB_CLK_P
9364_RESETB: J2.h31 ; port AD9364_SIG.RESETB
9364_RX_D0_N: J2.h8 ; port AD9364_SIG.RX_D0_N
9364_RX_D0_P: J2.h7 ; port AD9364_SIG.RX_D0_P
9364_RX_D1_N: J2.g10 ; port AD9364_SIG.RX_D1_N
9364_RX_D1_P: J2.g9 ; port AD9364_SIG.RX_D1_P
9364_RX_D2_N: J2.h11 ; port AD9364_SIG.RX_D2_N
9364_RX_D2_P: J2.h10 ; port AD9364_SIG.RX_D2_P
9364_RX_D3_N: J2.d12 ; port AD9364_SIG.RX_D3_N
9364_RX_D3_P: J2.d11 ; port AD9364_SIG.RX_D3_P
9364_RX_D4_N: J2.c11 ; port AD9364_SIG.RX_D4_N
9364_RX_D4_P: J2.c10 ; port AD9364_SIG.RX_D4_P
9364_RX_D5_N: J2.h14 ; port AD9364_SIG.RX_D5_N
9364_RX_D5_P: J2.h13 ; port AD9364_SIG.RX_D5_P
9364_RX_FRAME_N: J2.d9 ; port AD9364_SIG.RX_FRAME_N
9364_RX_FRAME_P: J2.d8 ; port AD9364_SIG.RX_FRAME_P
9364_SPI_CLK: R2.1 ; port AD9364_SIG.SPI_CLK
9364_SPI_DI: J2.c26 ; port AD9364_SIG.SPI_DI
9364_SPI_DO: J2.c27 ; port AD9364_SIG.SPI_DO
9364_SPI_ENB: J2.d26 ; port AD9364_SIG.SPI_ENB
9364_SYNC_IN: J2.c22 J2.h23 ; port SYNC_IN, port AD9364_SIG.SYNC_IN
9364_TX_D0_N: J2.h17 ; port AD9364_SIG.TX_D0_N
9364_TX_D0_P: J2.h16 ; port AD9364_SIG.TX_D0_P
9364_TX_D1_N: J2.g16 ; port AD9364_SIG.TX_D1_N
9364_TX_D1_P: J2.g15 ; port AD9364_SIG.TX_D1_P
9364_TX_D2_N: J2.d18 ; port AD9364_SIG.TX_D2_N
9364_TX_D2_P: J2.d17 ; port AD9364_SIG.TX_D2_P
9364_TX_D3_N: J2.c15 ; port AD9364_SIG.TX_D3_N
9364_TX_D3_P: J2.c14 ; port AD9364_SIG.TX_D3_P
9364_TX_D4_N: J2.c19 ; port AD9364_SIG.TX_D4_N
9364_TX_D4_P: J2.c18 ; port AD9364_SIG.TX_D4_P
9364_TX_D5_N: J2.h20 ; port AD9364_SIG.TX_D5_N
9364_TX_D5_P: J2.h19 ; port AD9364_SIG.TX_D5_P
9364_TX_FRAME_N: J2.d15 ; port AD9364_SIG.TX_FRAME_N
9364_TX_FRAME_P: J2.d14 ; port AD9364_SIG.TX_FRAME_P
9364_TXNRX: J2.g19 ; port AD9364_SIG.TXNRX
CLK1_M2C_N: J2.g3
CLK1_M2C_P: J2.g2
FE_LOCK_DETECT: J2.h38 ; port FE_SPI.LOCK_DETECT
FE_SPI_CE: J2.h37 ; port FE_SPI.SPI_CE
FE_SPI_CLK: J2.h32 ; port FE_SPI.SPI_CLK
FE_SPI_DATA: J2.h34 ; port FE_SPI.SPI_DATA
FE_SPI_LE: J2.h35 ; port FE_SPI.SPI_LE
PGood_FMC: J2.d1 ; port PG_FMC
SynchronizeDCDC: J2.d20 ; port SYNC_BUCK
NetBSC12_1: J2.g34 ; port CR_NSHDN
NetBSC15_1: J2.g30 ; port RX_SHDN
NetBSC16_1: J2.g31 ; port TX_SHDN
NetBSC17_1: J2.g33 ; port FE_SHDN_DEEP
NetIC1_11: J2.c34 ; port GA0
NetIC1_13: J2.d35 ; port GA1
NetIC1_14: J2.c30 ; port SCL
NetIC1_15: J2.c31 ; port SDA
NetIC3_3: J2.c23 ; port ALERT
NetJ2_d27: J2.d27 R2.2
NetJ2_d30: J2.d30 J2.d31

Not connected (* = marked no-connect by the designer): J2 c2* c3* c6* c7* d4* d5* d21* d29* d33* d34* g36* g37* h1* h5*

### Notes on the sheet
- To SDRAM bank
- (near J2) DP0_C2M_P
- PRSNT_M2C_L
- (near J2) DP0_C2M_N
- (near J2) DP0_M2C_P
- (near J2) DP0_M2C_N
- (near J2) LA01_CC_P
- (near J2) GBTCLK0_M2C_P
- (near J2) GBTCLK0_M2C_N
- (near J2) LA00_CC_P
- (near J2) LA00_CC_N
- (near J2) CLK0_M2C_P
- (near J2) CLK0_M2C_N
- (near J2) LA02_P
- (near J2) LA02_N
- (near J2) LA06_P
- (near J2) LA06_N
- (near J2) LA01_CC_N
- (near J2) LA05_P
- (near J2) LA05_N
- (near J2) LA03_P
- (near J2) LA03_N
- (near J2) LA08_P
- (near J2) LA04_P
- (near J2) LA04_N
- (near J2) LA10_P
- (near J2) LA10_N
- (near J2) LA14_P
- (near J2) LA09_P
- (near J2) LA09_N
- (near J2) LA13_P
- (near J2) LA13_N
- (near J2) LA08_N
- (near J2) LA12_P
- (near J2) LA12_N
- (near J2) LA16_P
- (near J2) LA07_P
- (near J2) LA07_N
- (near J2) LA11_P
- (near J2) LA11_N
- (near J2) LA14_N
- (near J2) LA18_CC_P
- (near J2) LA17_CC_P
- (near J2) LA17_CC_N
- (near J2) LA16_N
- (near J2) LA20_P
- (near J2) LA20_N
- (near J2) LA15_P
- (near J2) LA15_N
- (near J2) LA19_P
- (near J2) LA18_CC_N
- (near J2) LA27_P
- (near J2) LA27_N
- (near J2) LA23_P
- (near J2) LA23_N
- (near J2) LA26_P
- (near J2) LA26_N
- (near J2) LA22_P
- (near J2) LA22_N
- (near J2) LA25_P
- (near J2) LA25_N
- (near J2) LA19_N
- (near J2) LA21_P
- (near J2) LA21_N
- (near J2) LA24_P
- (near R2) TDI
- (near R2) TDO
- (near J2) LA29_P
- (near J2) LA29_N
- (near J2) LA24_N
- (near J2) LA28_P
- (near J2) LA28_N
- (near J2) LA31_P
- (near J2) LA31_N
- (near J2) LA33_P
- (near J2) LA33_N
- (near J2) LA30_P
- (near J2) LA30_N
- (near J2) LA32_P
- (near J2) LA32_N
- Project/Equipment
- Document
- Designer
- Drawn by
- Check.by
- File
- Last Mod.
- Print Date
- Sheet
- Size
- A3
- of
- Rev
- (in symbol R0402_49R9_1%_0.0625W_100PPM) 1%

### Library data of the parts
J2 = SAMTEC_ASP-127797-01: Connector VITA 57, 160 Male contacts in 4 row cdgh; Part Description: 160 contacts (4 rows cdgh) Surface Mount Male Connector, VITA 57; Manufacturer: SAMTEC; Manufacturer Part Number: ASP-134488-01; Part Number: SAMTEC_ASP-127797-01; Component Kind: Standard; Component Type: Standard; Designator: Connector VITA 57 160 Male (cdgh); Library Reference: Connector VITA 57 160 Male (cdgh); Pin Count: 160; Family: VITA 57; Mounted: Yes; Socket: No; SMD: Yes; Status: None; ComponentHeight: 6.1mm; Datasheet: \\cern.ch\dfs\Applications\Altium\Datasheets\SAMTEC_ASP-127797-01.pdf; HelpURL: \\cern.ch\dfs\Applications\Altium\Datasheets\SAMTEC_ASP-127797-01.pdf; Author: CERN DEM JLC; CreateDate: 9/24/2009; LatestRevisionDate: 9/24/2009; Table: SAMTEC
R2 = R0402_49R9_1%_0.0625W_100PPM: as R11 on sheet Transceiver; Part Number: R0402_49R9_1%_0.0625W_100PPM; Component Kind: Standard; Component Type: Standard; Pin Count: 2; Value: 49R9; Status: Not Recommended; Power: 0.0625W; Tolerance: ±1%; Manufacturer Part Number: R0402_49R9_1%_0.0625W_100PPM; Case: 0402; Mounted: Yes; Sense: No; Socket: No; SMD: Yes; Manufacturer1 Example: YAGEO PHYCOMP; Manufacturer1 ComponentHeight: 0.4mm; HelpURL: \\cern.ch\dfs\Applications\Altium\Datasheets\R0402_Phycomp_RC0402.pdf; Author: CERN DEM JLC; CreateDate: 24.10.2012; LatestRevisionDate: 24.10.2012

## Sheet GroundsCoupling.SchDoc: FMC SDR Transceiver Board
size 420 x 297 mm; CheckedBy: -; CompanyName: CERN; DrawnBy: DrawnBy; Organization: CERN; Address1: European Organization for Nuclear Research; Address2: CH-1211 Genčve 23 - Switzerland; Revision: -; SheetNumber: -; SheetTotal: -; EDA_Number: EDA-XXXXX-VX-X; Projet: -; ModifiedBy: -; CreateDate: XX/XX/XXXX; CheckedDate: -; Title2: Shield Coupling; DivGrp: TE/MPE; Designer: Designer; ModifiedDate: -
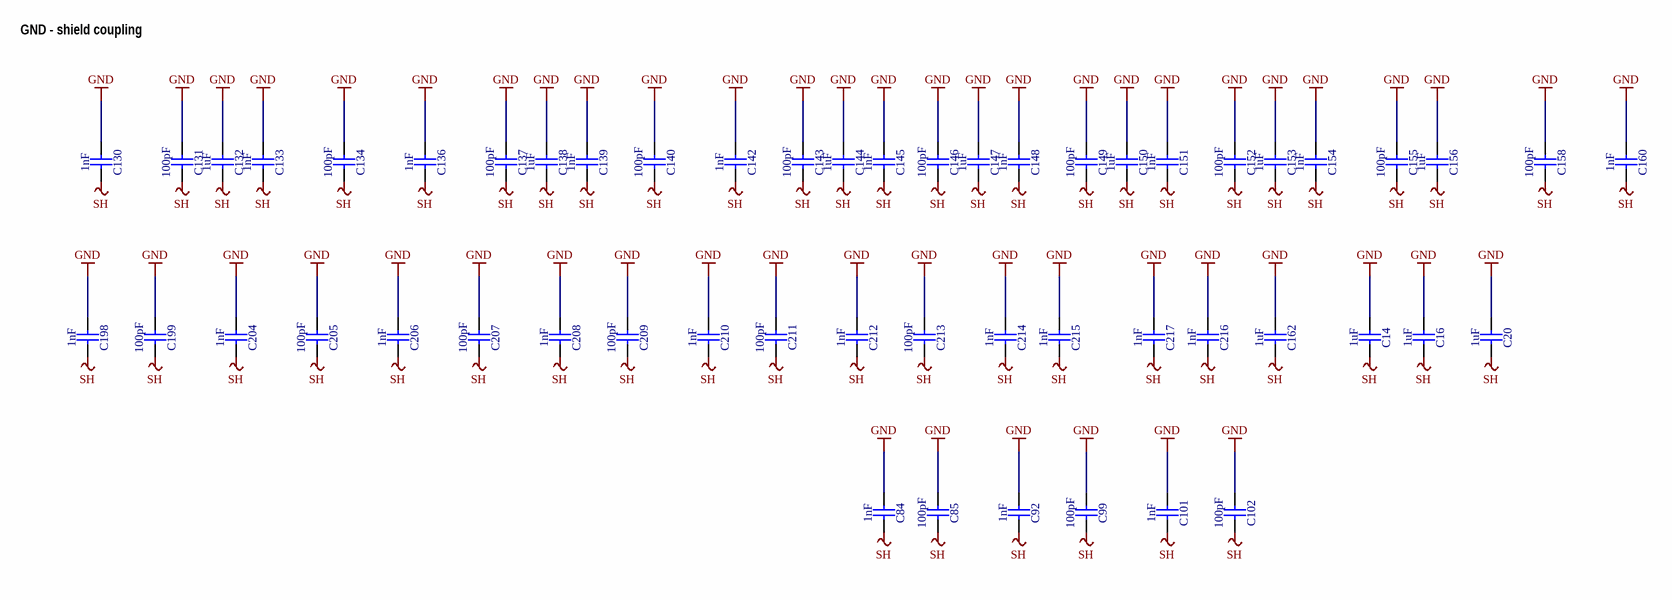
[diagram p5: GroundsCoupling.SchDoc]

### Parts
C14  1uF  [CAPC3216X140N]
C16  1uF  [CAPC3216X140N]
C20  1uF  [CAPC3216X140N]
C84  1nF  [CAPC1005X55N]
C85  100pF  [CAPC1005X55N]
C92  1nF  [CAPC1005X55N]
C99  100pF  [CAPC1005X55N]
C101  1nF  [CAPC1005X55N]
C102  100pF  [CAPC1005X55N]
C130  1nF  [CAPC1005X55N]
C131  100pF  [CAPC1005X55N]
C132  1uF  [CAPC3216X140N]
C133  1nF  [CAPC1005X55N]
C134  100pF  [CAPC1005X55N]
C136  1nF  [CAPC1005X55N]
C137  100pF  [CAPC1005X55N]
C138  1uF  [CAPC3216X140N]
C139  1nF  [CAPC1005X55N]
C140  100pF  [CAPC1005X55N]
C142  1nF  [CAPC1005X55N]
C143  100pF  [CAPC1005X55N]
C144  1uF  [CAPC3216X140N]
C145  1nF  [CAPC1005X55N]
C146  100pF  [CAPC1005X55N]
C147  1uF  [CAPC3216X140N]
C148  1nF  [CAPC1005X55N]
C149  100pF  [CAPC1005X55N]
C150  1uF  [CAPC3216X140N]
C151  1nF  [CAPC1005X55N]
C152  100pF  [CAPC1005X55N]
C153  1uF  [CAPC3216X140N]
C154  1nF  [CAPC1005X55N]
C155  100pF  [CAPC1005X55N]
C156  1uF  [CAPC3216X140N]
C158  100pF  [CAPC1005X55N]
C160  1nF  [CAPC1005X55N]
C162  1uF  [CAPC3216X140N]
C198  1nF  [CAPC1005X55N]
C199  100pF  [CAPC1005X55N]
C204  1nF  [CAPC1005X55N]
C205  100pF  [CAPC1005X55N]
C206  1nF  [CAPC1005X55N]
C207  100pF  [CAPC1005X55N]
C208  1nF  [CAPC1005X55N]
C209  100pF  [CAPC1005X55N]
C210  1nF  [CAPC1005X55N]
C211  100pF  [CAPC1005X55N]
C212  1nF  [CAPC1005X55N]
C213  100pF  [CAPC1005X55N]
C214  1nF  [CAPC1005X55N]
C215  1nF  [CAPC1005X55N]
C216  1nF  [CAPC1005X55N]
C217  1nF  [CAPC1005X55N]

### Nets
GND: C14.1 C16.1 C20.1 C84.1 C85.1 C92.1 C99.1 C101.1 C102.1 C130.1 C131.1 C132.1 C133.1 C134.1 C136.1 C137.1 C138.1 C139.1 C140.1 C142.1 C143.1 C144.1 C145.1 C146.1 C147.1 C148.1 C149.1 C150.1 C151.1 C152.1 C153.1 C154.1 C155.1 C156.1 C158.1 C160.1 C162.1 C198.1 C199.1 C204.1 C205.1 C206.1 C207.1 C208.1 C209.1 C210.1 C211.1 C212.1 C213.1 C214.1 C215.1 C216.1 C217.1
SH: C14.2 C16.2 C20.2 C84.2 C85.2 C92.2 C99.2 C101.2 C102.2 C130.2 C131.2 C132.2 C133.2 C134.2 C136.2 C137.2 C138.2 C139.2 C140.2 C142.2 C143.2 C144.2 C145.2 C146.2 C147.2 C148.2 C149.2 C150.2 C151.2 C152.2 C153.2 C154.2 C155.2 C156.2 C158.2 C160.2 C162.2 C198.2 C199.2 C204.2 C205.2 C206.2 C207.2 C208.2 C209.2 C210.2 C211.2 C212.2 C213.2 C214.2 C215.2 C216.2 C217.2

### Notes on the sheet
- GND - shield coupling
- Project/Equipment
- Document
- Designer
- Drawn by
- Check.by
- File
- Last Mod.
- Print Date
- Sheet
- Size
- A3
- of
- Rev

### Library data of the parts
C14 C16 C20 C132 C138 C144 C147 C150 C153 C156 C162 = CC1206_1UF_50V_10%_X7R: Non-polarised capacitor; Part Description: SMD Multilayer Chip Ceramic Capacitor; Manufacturer: GENERIC; Manufacturer1 Part Number: C1206F105K5RACTU; Voltage: 50V; TC: X7R; Tolerance: ±10%; Part Number: CC1206_1UF_50V_10%_X7R; Component Kind: Standard; Component Type: Standard; Pin Count: 2; Value: 1uF; Status: Preferred; Manufacturer Part Number: CC1206_1UF_50V_10%_X7R; Case: 1206; Mounted: Yes; Socket: No; SMD: Yes; Sense: No; Manufacturer1 Example: KEMET; Manufacturer1 ComponentHeight: 1.8mm; HelpURL: \\cern.ch\dfs\Applications\Altium\Datasheets\CC1206_X7R_KEMET_OPENMODE.pdf; Author: CERN DEM JLC; CreateDate: 07.11.2012; LatestRevisionDate: 07.11.2012
C84 C92 C101 C130 C133 C136 C139 C142 C145 C148 C151 C154 C160 C198 C204 C206 C208 C210 C212 C214-C217 = CC0402_1NF_50V_10%_X7R: as C8 on sheet Transceiver; Part Number: CC0402_1NF_50V_10%_X7R; Component Kind: Standard; Component Type: Standard; Pin Count: 2; Value: 1nF; Status: Not Recommended; Manufacturer Part Number: CC0402_1NF_50V_10%_X7R; Case: 0402; Mounted: Yes; Socket: No; SMD: Yes; Sense: No; Manufacturer1 Example: PHYCOMP; Manufacturer1 ComponentHeight: 0.55mm; HelpURL: \\cern.ch\dfs\Applications\Altium\Datasheets\CC0402_X7R_PHYCOMP.pdf; Author: CERN DEM JLC; CreateDate: 03.12.2007; LatestRevisionDate: 03.12.2007
C85 C99 C102 C131 C134 C137 C140 C143 C146 C149 C152 C155 C158 C199 C205 C207 C209 C211 C213 = CC0402_100PF_50V_5%_C0G: as C9 on sheet Transceiver; Part Number: CC0402_100PF_50V_5%_C0G; Component Kind: Standard; Component Type: Standard; Pin Count: 2; Value: 100pF; Status: Preferred; Manufacturer Part Number: CC0402_100PF_50V_5%_C0G; Case: 0402; Mounted: Yes; Socket: No; SMD: Yes; Sense: No; Manufacturer1 Example: KEMET; Manufacturer1 ComponentHeight: 0.55mm; HelpURL: \\cern.ch\dfs\Applications\Altium\Datasheets\CC0805_C0G_KEMET_(Commercial Grade).pdf; Author: CERN DEM JLC; CreateDate: 03.12.2007; LatestRevisionDate: 22.04.2015

## Nets that join several sheets
1P3_SUPPLY_A: ipmi (R15.2), power_supplies (8 pins), Transceiver (6 pins)
1P3_SUPPLY_B: ipmi (R17.2), power_supplies (14 pins), Transceiver (13 pins)
GND: ipmi (27 pins), power_supplies (82 pins), Transceiver (64 pins), fmc_connector (62 pins), GroundsCoupling (53 pins)
P3V3: FMC_SDR_top (BSC19.1), ipmi (R4.2), power_supplies (C37.2 C38.2 L7.1), fmc_connector (J2.c39 J2.d36 J2.d38 J2.d40)
P3V3_AUX: ipmi (10 pins), fmc_connector (J2.d32)
P12V0: FMC_SDR_top (BSC18.1), power_supplies (C50.2 C51.2 L10.1), fmc_connector (J2.c35 J2.c37)
SH: FMC_SDR_top (23 pins), GroundsCoupling (53 pins)
VADJ: ipmi (R1.2), power_supplies (C28.2 C29.2 L6.1), fmc_connector (J2.g39 J2.h40)
VDD_INTERFACE: ipmi (R16.2), power_supplies (9 pins), Transceiver (IC6.H12 R5.1 R6.1)
VDDA_GPO: power_supplies (6 pins), Transceiver (IC6.B8)
9364_CLK_OUT: Transceiver (IC6.J6), fmc_connector (J2.h4)
9364_CTRL_IN0: Transceiver (IC6.C5), fmc_connector (J2.h28)
9364_CTRL_IN1: Transceiver (IC6.C6), fmc_connector (J2.h29)
9364_CTRL_IN2: Transceiver (IC6.D6), fmc_connector (J2.g27)
9364_CTRL_IN3: Transceiver (IC6.D5), fmc_connector (J2.g28)
9364_CTRL_OUT0: Transceiver (IC6.D4), fmc_connector (J2.g21)
9364_CTRL_OUT1: Transceiver (IC6.E4), fmc_connector (J2.g22)
9364_CTRL_OUT2: Transceiver (IC6.E5), fmc_connector (J2.h25)
9364_CTRL_OUT3: Transceiver (IC6.E6), fmc_connector (J2.h26)
9364_CTRL_OUT4: Transceiver (IC6.F6), fmc_connector (J2.g24)
9364_CTRL_OUT5: Transceiver (IC6.F5), fmc_connector (J2.g25)
9364_CTRL_OUT6: Transceiver (IC6.F4), fmc_connector (J2.d23)
9364_CTRL_OUT7: Transceiver (IC6.G4), fmc_connector (J2.d24)
9364_DATA_CLK_N: Transceiver (IC6.H11), fmc_connector (J2.g7)
9364_DATA_CLK_P: Transceiver (IC6.G11), fmc_connector (J2.g6)
9364_EN_AGC: Transceiver (IC6.G5), fmc_connector (J2.h22)
9364_ENABLE: Transceiver (IC6.G6), fmc_connector (J2.g18)
9364_FB_CLK_N: Transceiver (IC6.G10), fmc_connector (J2.g13)
9364_FB_CLK_P: Transceiver (IC6.F10), fmc_connector (J2.g12)
9364_RESETB: Transceiver (IC6.K5 R6.2), fmc_connector (J2.h31)
9364_RX_D0_N: Transceiver (IC6.K11), fmc_connector (J2.h8)
9364_RX_D0_P: Transceiver (IC6.J12), fmc_connector (J2.h7)
9364_RX_D1_N: Transceiver (IC6.K10), fmc_connector (J2.g10)
9364_RX_D1_P: Transceiver (IC6.J11), fmc_connector (J2.g9)
9364_RX_D2_N: Transceiver (IC6.K9), fmc_connector (J2.h11)
9364_RX_D2_P: Transceiver (IC6.J10), fmc_connector (J2.h10)
9364_RX_D3_N: Transceiver (IC6.K8), fmc_connector (J2.d12)
9364_RX_D3_P: Transceiver (IC6.J9), fmc_connector (J2.d11)
9364_RX_D4_N: Transceiver (IC6.K7), fmc_connector (J2.c11)
9364_RX_D4_P: Transceiver (IC6.J8), fmc_connector (J2.c10)
9364_RX_D5_N: Transceiver (IC6.J7), fmc_connector (J2.h14)
9364_RX_D5_P: Transceiver (IC6.H8), fmc_connector (J2.h13)
9364_RX_FRAME_N: Transceiver (IC6.G7), fmc_connector (J2.d9)
9364_RX_FRAME_P: Transceiver (IC6.G8), fmc_connector (J2.d8)
9364_SPI_CLK: Transceiver (IC6.J5), fmc_connector (R2.1)
9364_SPI_DI: Transceiver (IC6.J4), fmc_connector (J2.c26)
9364_SPI_DO: Transceiver (IC6.L6), fmc_connector (J2.c27)
9364_SPI_ENB: Transceiver (IC6.K6 R5.2), fmc_connector (J2.d26)
9364_SYNC_IN: Transceiver (IC6.H5 R8.2), fmc_connector (J2.c22 J2.h23)
9364_TX_D0_N: Transceiver (IC6.E12), fmc_connector (J2.h17)
9364_TX_D0_P: Transceiver (IC6.D11), fmc_connector (J2.h16)
9364_TX_D1_N: Transceiver (IC6.E11), fmc_connector (J2.g16)
9364_TX_D1_P: Transceiver (IC6.D10), fmc_connector (J2.g15)
9364_TX_D2_N: Transceiver (IC6.E10), fmc_connector (J2.d18)
9364_TX_D2_P: Transceiver (IC6.D9), fmc_connector (J2.d17)
9364_TX_D3_N: Transceiver (IC6.E9), fmc_connector (J2.c15)
9364_TX_D3_P: Transceiver (IC6.D8), fmc_connector (J2.c14)
9364_TX_D4_N: Transceiver (IC6.E8), fmc_connector (J2.c19)
9364_TX_D4_P: Transceiver (IC6.D7), fmc_connector (J2.c18)
9364_TX_D5_N: Transceiver (IC6.F8), fmc_connector (J2.h20)
9364_TX_D5_P: Transceiver (IC6.E7), fmc_connector (J2.h19)
9364_TX_FRAME_N: Transceiver (IC6.H9), fmc_connector (J2.d15)
9364_TX_FRAME_P: Transceiver (IC6.G9), fmc_connector (J2.d14)
9364_TXNRX: FMC_SDR_top (BSC4.1), Transceiver (IC6.H4), fmc_connector (J2.g19)
FE_LOCK_DETECT: FMC_SDR_top (BSC20.1), fmc_connector (J2.h38)
FE_SPI_CE: FMC_SDR_top (BSC13.1), fmc_connector (J2.h37)
FE_SPI_CLK: FMC_SDR_top (BSC8.1), fmc_connector (J2.h32)
FE_SPI_DATA: FMC_SDR_top (BSC10.1), fmc_connector (J2.h34)
FE_SPI_LE: FMC_SDR_top (BSC11.1), fmc_connector (J2.h35)
NetBSC1_1: FMC_SDR_top (BSC1.1), Transceiver (TR5.3)
NetBSC2_1: FMC_SDR_top (BSC2.1), Transceiver (C93.1 R11.2)
NetBSC3_1: FMC_SDR_top (BSC3.1), Transceiver (R35.1 R36.2)
NetBSC5_1: FMC_SDR_top (BSC5.1), Transceiver (TR6.3)
NetBSC12_1: FMC_SDR_top (BSC12.1), fmc_connector (J2.g34)
NetBSC14_1: FMC_SDR_top (BSC14.1), Transceiver (IC6.B3)
NetBSC15_1: FMC_SDR_top (BSC15.1), fmc_connector (J2.g30)
NetBSC16_1: FMC_SDR_top (BSC16.1), fmc_connector (J2.g31)
NetBSC17_1: FMC_SDR_top (BSC17.1), fmc_connector (J2.g33)
NetBSC21_1: FMC_SDR_top (BSC21.1), Transceiver (IC6.L5)
NetIC1_11: ipmi (IC1.11 IC2.2 IC3.6), fmc_connector (J2.c34)
NetIC1_13: ipmi (IC1.13 IC2.1 IC3.7), fmc_connector (J2.d35)
NetIC1_14: ipmi (IC1.14 IC2.5 IC3.1), fmc_connector (J2.c30)
NetIC1_15: ipmi (IC1.15 IC2.6 IC3.2), fmc_connector (J2.c31)
NetIC3_3: ipmi (IC3.3 R1.1), fmc_connector (J2.c23)
PGood_FMC: power_supplies (IC4.15), fmc_connector (J2.d1)
RX_EXT_LO: FMC_SDR_top (BSC7.1), Transceiver (IC6.G1)
SynchronizeDCDC: power_supplies (R23.2), fmc_connector (J2.d20)
TX_EXT_LO: FMC_SDR_top (BSC9.1), Transceiver (IC6.A12)